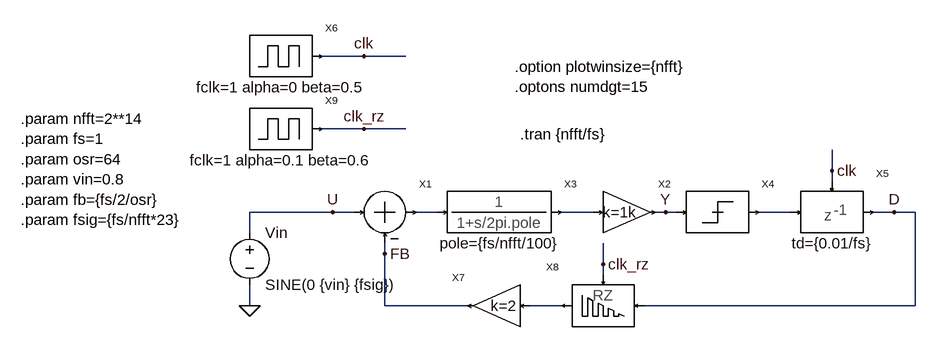
[diagram p0: schematic sample-ctdsm1-rz.asc]
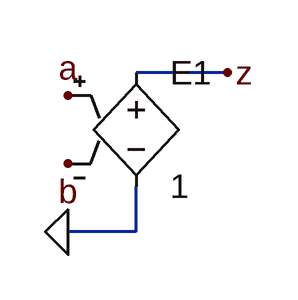
[diagram p1: sub-circuit sub.asc]
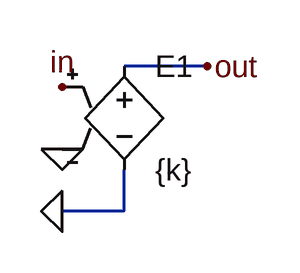
[diagram p2: sub-circuit gain.asc]
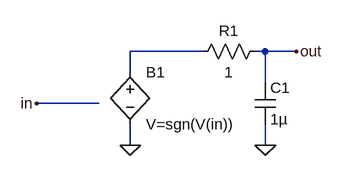
[diagram p3: sub-circuit sgn.asc]
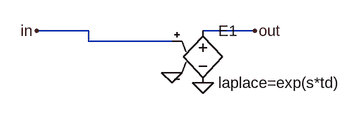
[diagram p4: sub-circuit delay.asc]
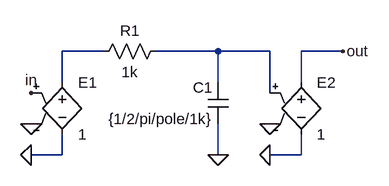
[diagram p5: sub-circuit pole.asc]
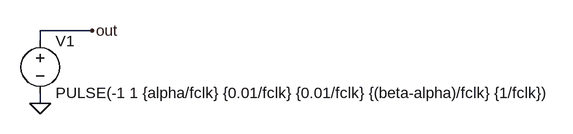
[diagram p6: sub-circuit clk.asc]
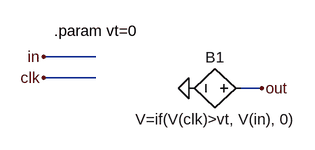
[diagram p7: sub-circuit return_to_zero.asc]
sample-ctdsm1-rz.asc, the LTspice schematic file:
Version 4
SHEET 1 884 680
WIRE 32 -80 -32 -80
WIRE 96 -80 32 -80
WIRE 32 32 -32 32
WIRE 96 32 32 32
WIRE 752 96 752 64
WIRE 752 112 752 96
WIRE -16 160 -144 160
WIRE 16 160 -16 160
WIRE 144 160 112 160
WIRE 384 160 336 160
WIRE 496 160 480 160
WIRE 512 160 496 160
WIRE 688 160 640 160
WIRE 848 160 816 160
WIRE 880 160 848 160
WIRE -144 192 -144 160
WIRE 64 224 64 208
WIRE 400 240 400 208
WIRE 400 256 400 240
WIRE -144 304 -144 272
WIRE 64 304 64 224
WIRE 192 304 64 304
WIRE 336 304 288 304
WIRE 880 304 880 160
WIRE 880 304 464 304
FLAG 752 96 clk
FLAG -144 304 0
FLAG 848 160 D
FLAG 496 160 Y
FLAG -16 160 U
FLAG 64 224 FB
FLAG 32 -80 clk
FLAG 400 240 clk_rz
FLAG 32 32 clk_rz
SYMBOL sub 64 160 R0
SYMATTR InstName X1
SYMBOL gain 432 160 R0
SYMATTR InstName X2
SYMATTR SpiceLine k=1k
SYMBOL sgn 576 160 R0
SYMATTR InstName X4
SYMBOL delay 752 160 R0
SYMATTR InstName X5
SYMATTR SpiceLine td={0.01/fs}
SYMBOL voltage -144 176 R0
WINDOW 123 0 0 Left 2
WINDOW 39 0 0 Left 2
SYMATTR InstName Vin
SYMATTR Value SINE(0 {vin} {fsig})
SYMBOL pole 240 160 R0
SYMATTR SpiceLine pole={fs/nfft/100}
SYMATTR InstName X3
SYMBOL gain 240 304 M0
SYMATTR InstName X7
SYMATTR SpiceLine k=2
SYMBOL clk -96 -80 R0
SYMATTR InstName X6
SYMBOL clk -96 32 R0
SYMATTR SpiceLine fclk=1 alpha=0.1 beta=0.6
SYMATTR InstName X9
SYMBOL return_to_zero 400 304 M0
SYMATTR InstName X8
TEXT 272 40 Left 2 !.tran {nfft/fs}
TEXT -496 16 Left 2 !.param nfft=2**14\n.param fs=1\n.param osr=64\n.param vin=0.8\n.param fb={fs/2/osr}\n.param fsig={fs/nfft*23}
TEXT 264 -64 Left 2 !.option plotwinsize={nfft}\n.optons numdgt=15

sub.asc, the sub-circuit schematic file:
Version 4
SHEET 1 880 680
WIRE 304 112 240 112
WIRE 240 224 240 192
WIRE 240 224 192 224
FLAG 192 128 a
FLAG 192 224 0
FLAG 304 112 z
FLAG 192 176 b
SYMBOL e 240 96 R0
SYMATTR InstName E1
SYMATTR Value 1

gain.asc, the sub-circuit schematic file:
Version 4
SHEET 1 880 680
WIRE 304 112 240 112
WIRE 240 224 240 192
WIRE 240 224 192 224
FLAG 192 128 in
FLAG 192 224 0
FLAG 304 112 out
FLAG 192 176 0
SYMBOL e 240 96 R0
SYMATTR InstName E1
SYMATTR Value {k}

sgn.asc, the sub-circuit schematic file:
Version 4
SHEET 1 880 680
WIRE 448 48 336 48
WIRE 544 48 528 48
WIRE 592 48 544 48
WIRE 336 80 336 48
WIRE 544 96 544 48
WIRE 288 128 192 128
WIRE 336 192 336 160
WIRE 544 192 544 160
FLAG 192 128 in
FLAG 592 48 out
FLAG 336 192 0
FLAG 544 192 0
SYMBOL bv 336 64 R0
SYMATTR InstName B1
SYMATTR Value V=sgn(V(in))
SYMBOL res 544 32 R90
WINDOW 0 0 56 VBottom 2
WINDOW 3 32 56 VTop 2
SYMATTR InstName R1
SYMATTR Value 1
SYMBOL cap 528 96 R0
SYMATTR InstName C1
SYMATTR Value 1µ

delay.asc, the sub-circuit schematic file:
Version 4
SHEET 1 880 680
WIRE 192 144 112 144
WIRE 448 144 368 144
WIRE 192 160 192 144
WIRE 320 160 192 160
FLAG 112 144 in
FLAG 448 144 out
FLAG 320 208 0
FLAG 368 224 0
SYMBOL e 368 128 R0
SYMATTR InstName E1
SYMATTR Value laplace=exp(s*td)

pole.asc, the sub-circuit schematic file:
Version 4
SHEET 1 880 680
WIRE 304 64 240 64
WIRE 480 64 384 64
WIRE 560 64 480 64
WIRE 672 64 608 64
WIRE 240 112 240 64
WIRE 480 112 480 64
WIRE 608 112 608 64
WIRE 560 128 560 64
WIRE 240 224 240 192
WIRE 240 224 192 224
WIRE 480 224 480 176
WIRE 608 224 608 192
WIRE 608 224 560 224
FLAG 192 128 in
FLAG 192 224 0
FLAG 672 64 out
FLAG 192 176 0
FLAG 480 224 0
FLAG 560 224 0
FLAG 560 176 0
SYMBOL e 240 96 R0
SYMATTR InstName E1
SYMATTR Value 1
SYMBOL res 400 48 R90
WINDOW 0 0 56 VBottom 2
WINDOW 3 32 56 VTop 2
SYMATTR InstName R1
SYMATTR Value 1k
SYMBOL cap 496 176 R180
WINDOW 0 24 56 Left 2
WINDOW 3 24 8 Left 2
SYMATTR InstName C1
SYMATTR Value {1/2/pi/pole/1k}
SYMBOL e 608 96 R0
SYMATTR InstName E2
SYMATTR Value 1

clk.asc, the sub-circuit schematic file:
Version 4
SHEET 1 1192 680
WIRE 448 144 368 144
WIRE 368 160 368 144
WIRE 368 256 368 240
FLAG 448 144 out
FLAG 368 256 0
SYMBOL voltage 368 144 R0
WINDOW 123 0 0 Left 2
WINDOW 39 0 0 Left 2
SYMATTR InstName V1
SYMATTR Value PULSE(-1 1 {alpha/fclk} {0.01/fclk} {0.01/fclk} {(beta-alpha)/fclk} {1/fclk})

return_to_zero.asc, the sub-circuit schematic file:
Version 4
SHEET 1 880 680
WIRE 192 96 112 96
WIRE 192 128 112 128
WIRE 448 144 416 144
FLAG 112 96 in
FLAG 112 128 clk
FLAG 448 144 out
FLAG 336 144 0
SYMBOL bv 432 144 R90
WINDOW 0 -32 56 VBottom 2
WINDOW 3 32 56 VTop 2
SYMATTR InstName B1
SYMATTR Value V=if(V(clk)>vt, V(in), 0)
TEXT 128 56 Left 2 !.param vt=0

The netlist it stands for:
* sample-ctdsm1-rz.asc
XX1 U FB N001 sub
XX2 N002 Y gain params: k=1k
XX4 Y N003 sgn
XX5 N003 D clk delay params: td={0.01/fs}
Vin U 0 SINE(0 {vin} {fsig})
XX3 N001 N002 pole params: pole={fs/nfft/100}
XX7 N004 FB gain params: k=2
XX6 clk clk params: fclk=1 alpha=0 beta=0.5
XX9 clk_rz clk params: fclk=1 alpha=0.1 beta=0.6
XX8 D N004 clk_rz return_to_zero

* block symbol definitions
.subckt sub a b z
E1 z 0 a b 1
.ends sub

.subckt gain in out
E1 out 0 in 0 {k}
.ends gain

.subckt sgn in out
B1 N001 0 V=sgn(V(in))
R1 out N001 1
C1 out 0 1µ
.ends sgn

.subckt delay in out clk
E1 out 0 in 0 laplace=exp(s*td)
.ends delay

.subckt pole in out
E1 N001 0 in 0 1
R1 N002 N001 1k
C1 0 N002 {1/2/pi/pole/1k}
E2 out 0 N002 0 1
.ends pole

.subckt clk out
V1 out 0 PULSE(-1 1 {alpha/fclk} {0.01/fclk} {0.01/fclk} {(beta-alpha)/fclk} {1/fclk})
.ends clk

.subckt return_to_zero in out clk
B1 out 0 V=if(V(clk)>vt, V(in), 0)
.param vt=0
.ends return_to_zero

.tran {nfft/fs}
.param nfft=2**14
.param fs=1
.param osr=64
.param vin=0.8
.param fb={fs/2/osr}
.param fsig={fs/nfft*23}
.option plotwinsize={nfft}
.optons numdgt=15
.backanno
.end